# Altium schematic sheet DIOT_SMA_EXT.schdoc: DIOT_SMA16
size 594 x 420 mm; Author: A.B.; CompanyName: WUT; DrawnBy: A.B.; Organization: WUT ISE; Address1: Warsaw Univeristy of Technology; Address2: Nowowiejska 15/19; DocumentNumber: 1; SheetNumber: 1; SheetTotal: 2; EDA_Number: DIOT; Projet: KASLI 3U subsystem; ModifiedBy: -; CreateDate: XX/XX/XXXX; CheckedDate: -; DivGrp: ISE; Designer: A.B.; ModifiedDate: -; ProjectName: KASLI 3U subsystem
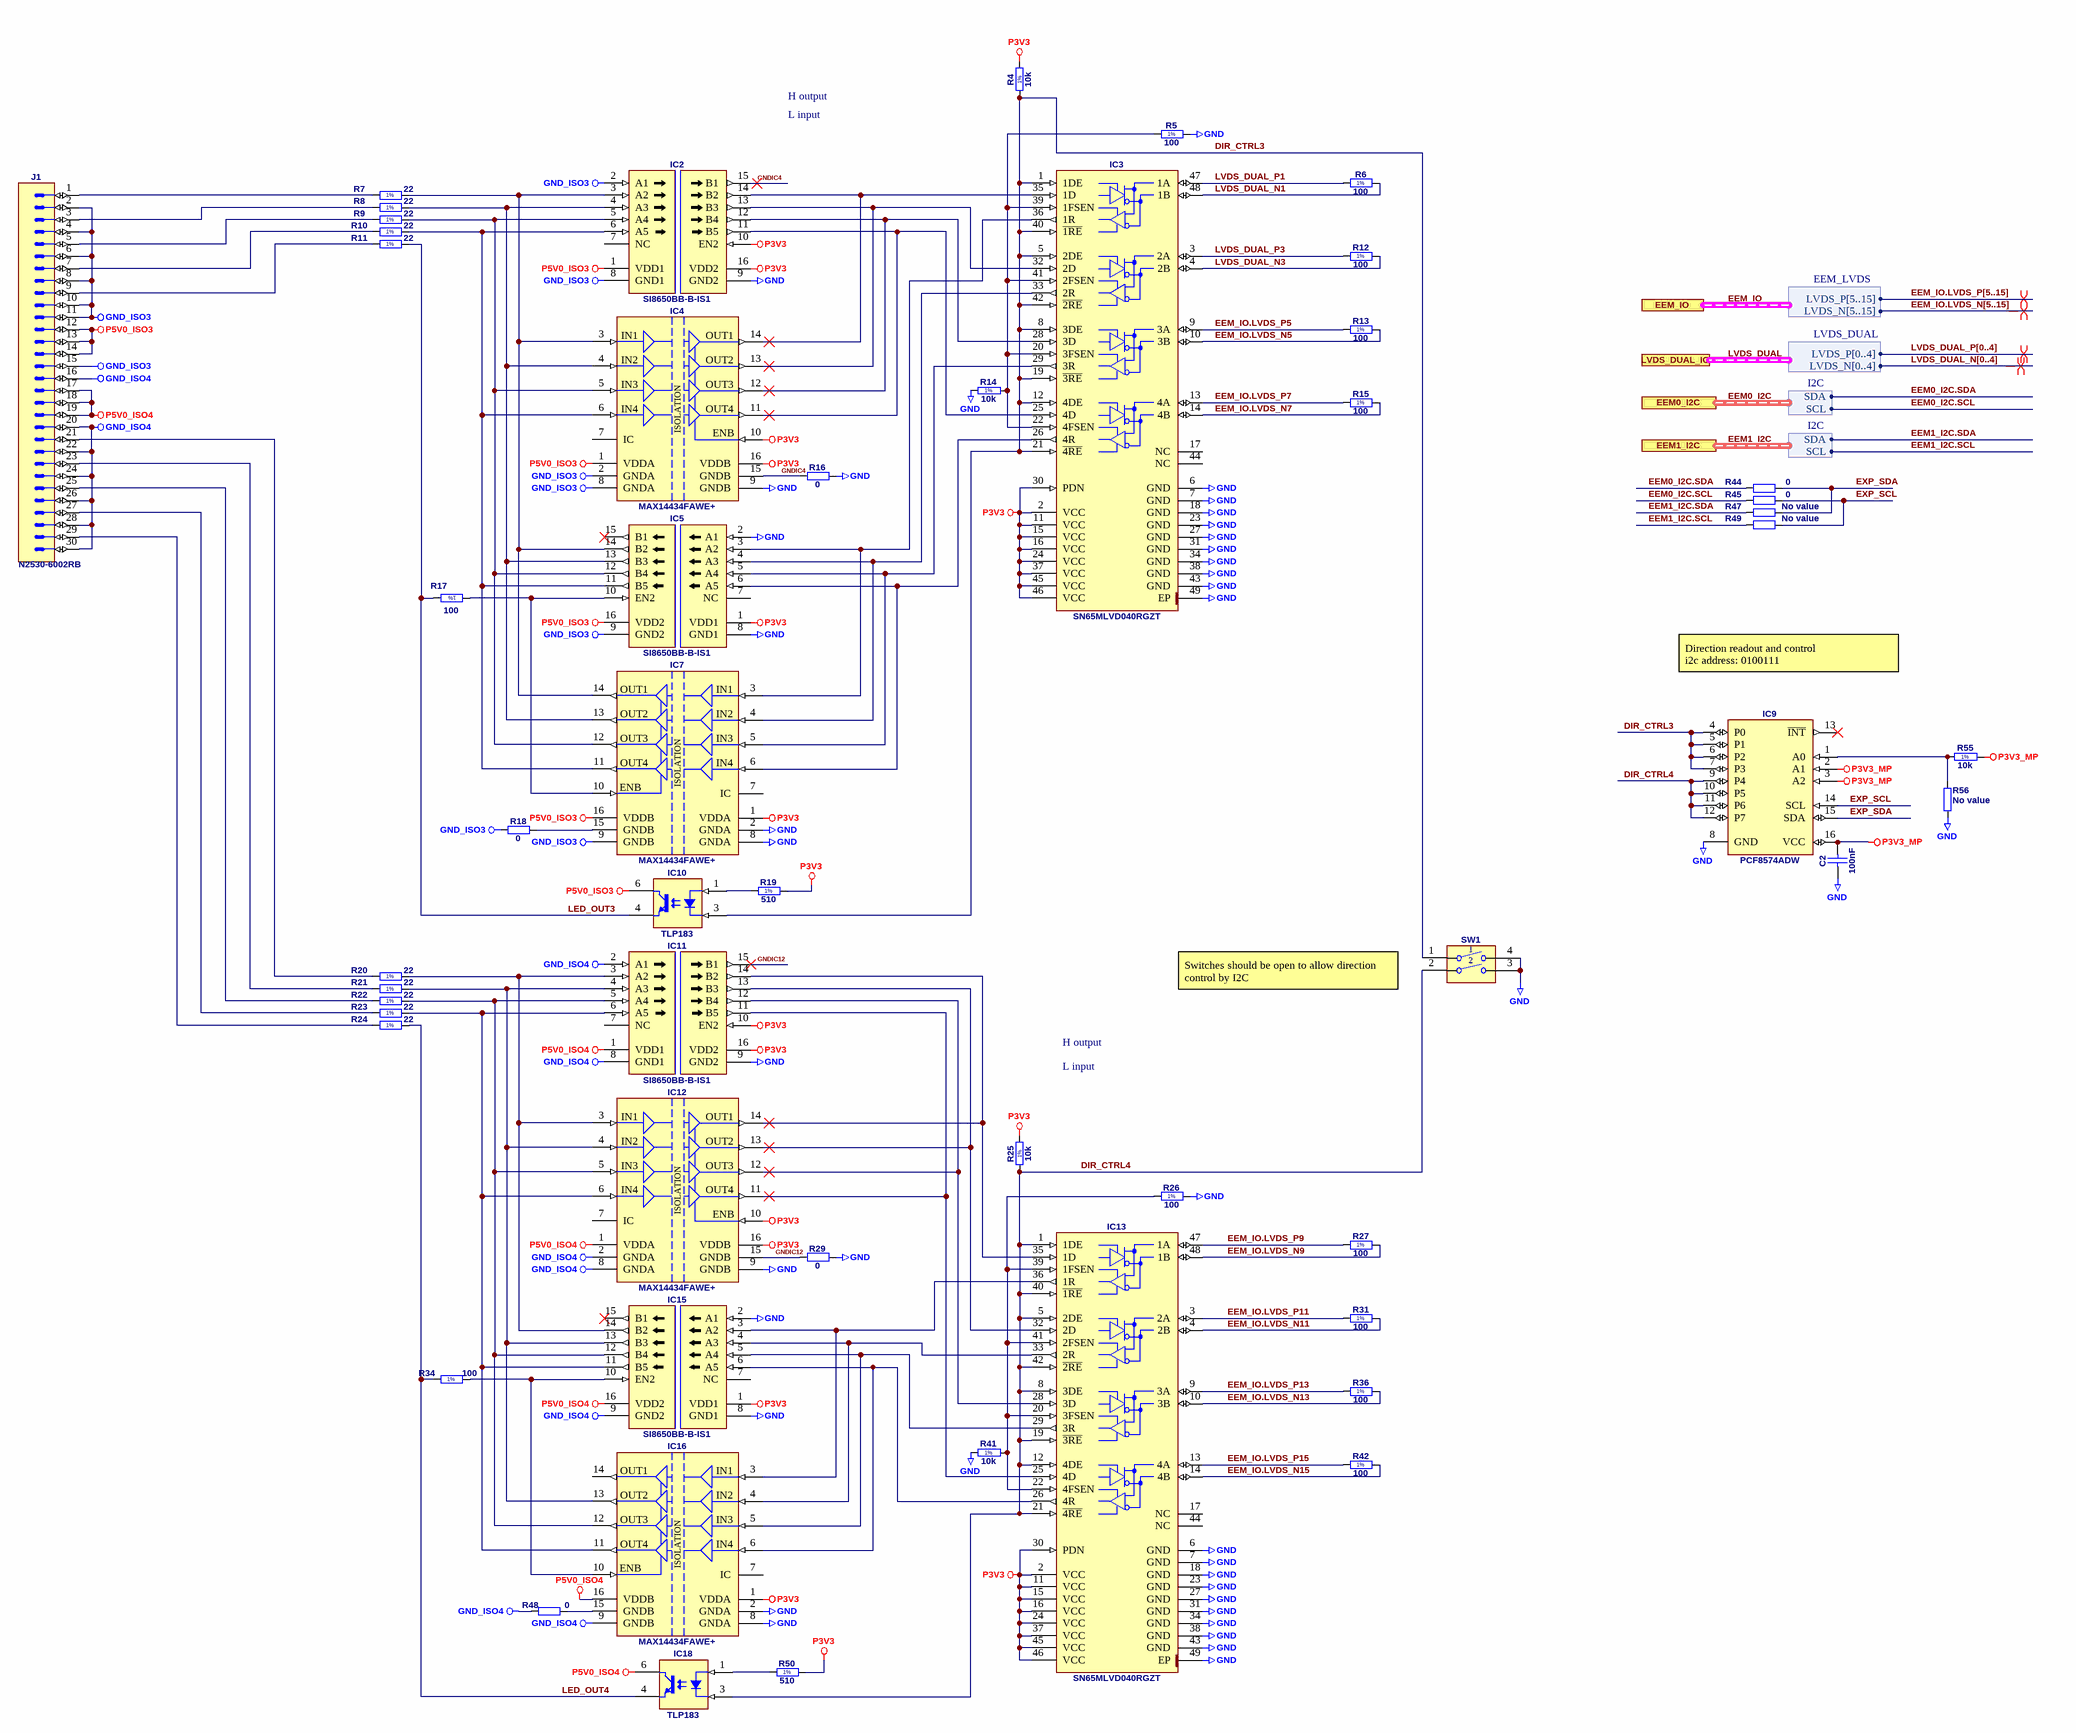
[diagram p0: DIOT_SMA_EXT.schdoc]

## Parts
C2  100nF  [CAPC1005X55N]
IC2  SI8650BB-B-IS1  [SOIC127P600X175-16N]
IC3  SN65MLVD040RGZT  [QFN50P700X700X100-49N-S420]
IC4  MAX14434FAWE+  [SOIC127P1030X265-16N]
IC5  SI8650BB-B-IS1  [SOIC127P600X175-16N]
IC7  MAX14434FAWE+  [SOIC127P1030X265-16N]
IC9  PCF8574ADW  [SOIC127P1030X265-16N]
IC10  TLP183  [TOSHIBA_11-4M1S]
IC11  SI8650BB-B-IS1  [SOIC127P600X175-16N]
IC12  MAX14434FAWE+  [SOIC127P1030X265-16N]
IC13  SN65MLVD040RGZT  [QFN50P700X700X100-49N-S420]
IC15  SI8650BB-B-IS1  [SOIC127P600X175-16N]
IC16  MAX14434FAWE+  [SOIC127P1030X265-16N]
IC18  TLP183  [TOSHIBA_11-4M1S]
J1  Manufacturer Part Number: N2530-6002RB  [3M_N2530-6002RB]
R4  10k  [RESC1005X40N]
R5  100  [RESC1005X40N]
R6  100  [RESC1005X40N]
R7  22  [RESC1005X40N]
R8  22  [RESC1005X40N]
R9  22  [RESC1005X40N]
R10  22  [RESC1005X40N]
R11  22  [RESC1005X40N]
R12  100  [RESC1005X40N]
R13  100  [RESC1005X40N]
R14  10k  [RESC1005X40N]
R15  100  [RESC1005X40N]
R16  0  [RESC1005X40N]
R17  100  [RESC1005X40N]
R18  0  [RESC1005X40N]
R19  510  [RESC1005X40N]
R20  22  [RESC1005X40N]
R21  22  [RESC1005X40N]
R22  22  [RESC1005X40N]
R23  22  [RESC1005X40N]
R24  22  [RESC1005X40N]
R25  10k  [RESC1005X40N]
R26  100  [RESC1005X40N]
R27  100  [RESC1005X40N]
R29  0  [RESC1005X40N]
R31  100  [RESC1005X40N]
R34  100  [RESC1005X40N]
R36  100  [RESC1005X40N]
R41  10k  [RESC1005X40N]
R42  100  [RESC1005X40N]
R44  0  [RESC1005X40N]
R45  0  [RESC1005X40N]
R47  No value  [RESC1005X40N]
R48  0  [RESC1005X40N]
R49  No value  [RESC1005X40N]
R50  510  [RESC1005X40N]
R55  10k  [RESC1005X40N]
R56  No value  [RESC1005X40N]
SW1  Switch  [SW_OMRON_A6S-2102-H]  (value not drawn)

## Ports
EEM0_I2C (harness I2C), EEM1_I2C (harness I2C), EEM_IO (harness EEM_LVDS), LVDS_DUAL_IO (harness LVDS_DUAL)

## Harnesses
EEM_LVDS: LVDS_P[5..15], LVDS_N[5..15]
LVDS_DUAL: LVDS_P[0..4], LVDS_N[0..4]
I2C: SDA, SCL

## Nets
GND: C2.1 IC2.9(GND2) IC3.6(GND) IC3.7(GND) IC3.18(GND) IC3.23(GND) IC3.27(GND) IC3.31(GND) IC3.34(GND) IC3.38(GND) IC3.43(GND) IC3.49(EP) IC4.9(GNDB) IC5.2(A1) IC5.8(GND1) IC7.2(GNDA) IC7.8(GNDA) IC9.8(GND) IC11.9(GND2) IC12.9(GNDB) IC13.6(GND) IC13.7(GND) IC13.18(GND) IC13.23(GND) IC13.27(GND) IC13.31(GND) IC13.34(GND) IC13.38(GND) IC13.43(GND) IC13.49(EP) IC15.2(A1) IC15.8(GND1) IC16.2(GNDA) IC16.8(GNDA) R5.2 R14.2 R16.2 R26.2 R29.2 R41.2 R56.1 SW1.3 SW1.4
GND_ISO3: IC2.2(A1) IC2.8(GND1) IC4.2(GNDA) IC4.8(GNDA) IC5.9(GND2) IC7.9(GNDB) J1.2 J1.4 J1.6 J1.8 J1.10 J1.11 J1.15 R18.1
GND_ISO4: IC11.2(A1) IC11.8(GND1) IC12.2(GNDA) IC12.8(GNDA) IC15.9(GND2) IC16.9(GNDB) J1.16 J1.20 J1.22 J1.24 J1.26 J1.28 J1.30 R48.1
P3V3: IC2.10(EN2) IC2.16(VDD2) IC3.2(VCC) IC3.11(VCC) IC3.15(VCC) IC3.16(VCC) IC3.24(VCC) IC3.30(PDN) IC3.37(VCC) IC3.45(VCC) IC3.46(VCC) IC4.10(ENB) IC4.16(VDDB) IC5.1(VDD1) IC7.1(VDDA) IC11.10(EN2) IC11.16(VDD2) IC12.10(ENB) IC12.16(VDDB) IC13.2(VCC) IC13.11(VCC) IC13.15(VCC) IC13.16(VCC) IC13.24(VCC) IC13.30(PDN) IC13.37(VCC) IC13.45(VCC) IC13.46(VCC) IC15.1(VDD1) IC16.1(VDDA) R4.2 R19.2 R25.2 R50.2
P3V3_MP: C2.2 IC9.2(A1) IC9.3(A2) IC9.16(VCC) R55.1
P5V0_ISO3: IC2.1(VDD1) IC4.1(VDDA) IC5.16(VDD2) IC7.16(VDDB) IC10.6(C) J1.12 J1.13 J1.14
P5V0_ISO4: IC11.1(VDD1) IC12.1(VDDA) IC15.16(VDD2) IC16.16(VDDB) IC18.6(C) J1.17 J1.18 J1.19
DIR_CTRL3: IC3.1(1DE) IC3.5(2DE) IC3.8(3DE) IC3.12(4DE) IC3.19(~{3RE}) IC3.21(~{4RE}) IC3.40(~{1RE}) IC3.42(~{2RE}) IC9.4(P0) IC9.5(P1) IC9.6(P2) IC9.7(P3) IC10.3(C) R4.1 SW1.1
DIR_CTRL4: IC9.9(P4) IC9.10(P5) IC9.11(P6) IC9.12(P7) IC13.1(1DE) IC13.5(2DE) IC13.8(3DE) IC13.12(4DE) IC13.19(~{3RE}) IC13.21(~{4RE}) IC13.40(~{1RE}) IC13.42(~{2RE}) IC18.3(C) R25.1 SW1.2
EEM0_I2C.SCL: R45.1 ; port EEM0_I2C.SCL
EEM0_I2C.SDA: R44.1 ; port EEM0_I2C.SDA
EEM1_I2C.SCL: R49.1 ; port EEM1_I2C.SCL
EEM1_I2C.SDA: R47.1 ; port EEM1_I2C.SDA
EEM_IO.LVDS_N5: IC3.10(3B) R13.2
EEM_IO.LVDS_N7: IC3.14(4B) R15.2
EEM_IO.LVDS_N9: IC13.48(1B) R27.2
EEM_IO.LVDS_N11: IC13.4(2B) R31.2
EEM_IO.LVDS_N13: IC13.10(3B) R36.2
EEM_IO.LVDS_N15: IC13.14(4B) R42.2
EEM_IO.LVDS_P5: IC3.9(3A) R13.1
EEM_IO.LVDS_P7: IC3.13(4A) R15.1
EEM_IO.LVDS_P9: IC13.47(1A) R27.1
EEM_IO.LVDS_P11: IC13.3(2A) R31.1
EEM_IO.LVDS_P13: IC13.9(3A) R36.1
EEM_IO.LVDS_P15: IC13.13(4A) R42.1
EXP_SCL: IC9.14(SCL) R45.2 R49.2
EXP_SDA: IC9.15(SDA) R44.2 R47.2
GNDIC4: IC2.15(B1) IC4.15(GNDB) R16.1
GNDIC12: IC11.15(B1) IC12.15(GNDB) R29.1
LED_OUT3: IC10.4(E) R11.2 R17.2
LED_OUT4: IC18.4(E) R24.2 R34.1
LVDS_DUAL_N1: IC3.48(1B) R6.2
LVDS_DUAL_N3: IC3.4(2B) R12.2
LVDS_DUAL_P1: IC3.47(1A) R6.1
LVDS_DUAL_P3: IC3.3(2A) R12.1
NetIC2_3: IC2.3(A2) IC4.3(IN1) IC5.14(B2) IC7.14(OUT1) R7.2
NetIC2_4: IC2.4(A3) IC4.4(IN2) IC5.13(B3) IC7.13(OUT2) R8.2
NetIC2_5: IC2.5(A4) IC4.5(IN3) IC5.12(B4) IC7.12(OUT3) R9.2
NetIC2_6: IC2.6(A5) IC4.6(IN4) IC5.11(B5) IC7.11(OUT4) R10.2
NetIC2_11: IC2.11(B5) IC3.25(4D) IC4.11(OUT4)
NetIC2_12: IC2.12(B4) IC3.28(3D) IC4.12(OUT3)
NetIC2_13: IC2.13(B3) IC3.32(2D) IC4.13(OUT2)
NetIC2_14: IC2.14(B2) IC3.35(1D) IC4.14(OUT1)
NetIC3_20: IC3.20(3FSEN) IC3.22(4FSEN) IC3.39(1FSEN) IC3.41(2FSEN) R5.1 R14.1
NetIC3_26: IC3.26(4R) IC5.6(A5) IC7.6(IN4)
NetIC3_29: IC3.29(3R) IC5.5(A4) IC7.5(IN3)
NetIC3_33: IC3.33(2R) IC5.4(A3) IC7.4(IN2)
NetIC3_36: IC3.36(1R) IC5.3(A2) IC7.3(IN1)
NetIC5_10: IC5.10(EN2) IC7.10(ENB) R17.1
NetIC7_15: IC7.15(GNDB) R18.2
NetIC9_1: IC9.1(A0) R55.2 R56.2
NetIC10_1: IC10.1(A) R19.1
NetIC11_3: IC11.3(A2) IC12.3(IN1) IC15.14(B2) R20.2
NetIC11_4: IC11.4(A3) IC12.4(IN2) IC15.13(B3) IC16.13(OUT2) R21.2
NetIC11_5: IC11.5(A4) IC12.5(IN3) IC15.12(B4) IC16.12(OUT3) R22.2
NetIC11_6: IC11.6(A5) IC12.6(IN4) IC15.11(B5) IC16.11(OUT4) R23.2
NetIC11_11: IC11.11(B5) IC12.11(OUT4) IC13.25(4D)
NetIC11_12: IC11.12(B4) IC12.12(OUT3) IC13.28(3D)
NetIC11_13: IC11.13(B3) IC12.13(OUT2) IC13.32(2D)
NetIC11_14: IC11.14(B2) IC12.14(OUT1) IC13.35(1D)
NetIC13_20: IC13.20(3FSEN) IC13.22(4FSEN) IC13.39(1FSEN) IC13.41(2FSEN) R26.1 R41.1
NetIC13_26: IC13.26(4R) IC15.6(A5) IC16.6(IN4)
NetIC13_29: IC13.29(3R) IC15.5(A4) IC16.5(IN3)
NetIC13_33: IC13.33(2R) IC15.4(A3) IC16.4(IN2)
NetIC13_36: IC13.36(1R) IC15.3(A2) IC16.3(IN1)
NetIC15_10: IC15.10(EN2) IC16.10(ENB) R34.2
NetIC16_15: IC16.15(GNDB) R48.2
NetIC18_1: IC18.1(A) R50.1
NetJ1_1: J1.1 R7.1
NetJ1_3: J1.3 R8.1
NetJ1_5: J1.5 R9.1
NetJ1_7: J1.7 R10.1
NetJ1_9: J1.9 R11.1
NetJ1_21: J1.21 R20.1
NetJ1_23: J1.23 R21.1
NetJ1_25: J1.25 R22.1
NetJ1_27: J1.27 R23.1
NetJ1_29: J1.29 R24.1

Not connected (* = marked no-connect by the designer): IC2 7(NC); IC3 17(NC) 44(NC); IC4 7(IC); IC5 7(NC) 15(B1)*; IC7 7(IC); IC9 13(~{INT})*; IC11 7(NC); IC12 7(IC); IC13 17(NC) 44(NC); IC15 7(NC) 15(B1)*; IC16 7(IC) 14(OUT1)

## Buses and harness runs
bus EEM_IO.LVDS_N[5..15]
bus EEM_IO.LVDS_P[5..15]
bus LVDS_DUAL_N[0..4]
bus LVDS_DUAL_P[0..4]
harness EEM0_I2C = port EEM0_I2C
harness EEM1_I2C = port EEM1_I2C
harness EEM_IO = port EEM_IO
harness LVDS_DUAL = port LVDS_DUAL_IO

## Layout directives
differential pair; differential pair class Diff_100Ohm: (no net found under the mark)

## Notes on the sheet
- H output
- L input
- Direction readout and control
  i2c address: 0100111
- Switches should be open to allow direction control by I2C
- Project/Equipment
- Document
- File
- Designer
- Drawn by
- Check.by
- Last Mod.
- Copyright WUT ISE 2020.
  This documentation describes Open Hardware and is licensed under the CERN OHL v.1.2. You may redistribute and modify this documentation under the terms of the CERN OHL v.1.2. (http://ohwr.org/CERNOHL). This documentation is distributed WITHOUT ANY EXPRESS OR IMPLIED WARRANTY, INCLUDING OF MERCHANTABILITY, SATISFACTORY QUALITY AND FITNESS FOR A PARTICULAR PURPOSE. Please see the CERN OHL v.1.2 for applicable conditions.
- Contact
- Print Date
- Sheet
- Size
- A2
- of
- Rev
- (in symbol MAX14434FAWE+) ISOLATION
- (in symbol R0402_10K_1%_0.0625W_100PPM) 1%
- (in symbol R0402_22R_1%_0.0625W_100PPM) 1%
- (in symbol R0402_100R_1%_0.1W_100PPM) 1%
- (in symbol R0402_510R_1%_0.0625W_100PPM) 1%

## Library data of the parts
C2 = CC0402_100NF_16V_10%_X5R: Non-polarised capacitor; Part Description: SMD Multilayer Chip Ceramic Capacitor; Manufacturer: GENERIC; Manufacturer1 Part Number: GRM155R61C104KA88D; Voltage: 16V; TC: X5R; Tolerance: ±10%; Part Number: CC0402_100NF_16V_10%_X5R; Component Kind: Standard; Component Type: Standard; Pin Count: 2; Value: 100nF; Status: None; Manufacturer Part Number: CC0402_100NF_16V_10%_X5R; Case: 0402; Mounted: Yes; Socket: No; SMD: Yes; Sense: No; Manufacturer1 Example: MURATA; Manufacturer1 ComponentHeight: 0.55mm; HelpURL: \\cern.ch\dfs\Applications\Altium\Datasheets\CC0402_X5R_MURATA_GRM.pdf; Author: CERN DEM JLC; CreateDate: 10.12.2013; LatestRevisionDate: 10.12.2013
IC2 IC5 IC11 IC15 = SI8650BB-B-IS1: Low Power Five-Channel Digital Isolator; Part Description: 2.5kV 150Mbps Low Power Five-Channel Digital Isolator; Manufacturer: SKYWORKS; Manufacturer Part Number: SI8651BB-B-IS1; PressFit: No; Bonding: No; Part Number: SI8650BB-B-IS1; Component Kind: Standard; Component Type: Standard; Device: SI8650BB-B-IS1; PackageDescription: SOIC 16, Pitch 1.27mm - Body 4x10mm, IPC Medium Density; Pin Count: 16; Case: SOIC16; Mounted: Yes; Socket: No; SMD: Yes; Sense: No; ComponentHeight: 1.75mm; Author: CERN DEM HF; HelpURL: \\cern.ch\dfs\Applications\Altium\Datasheets\SI8650BB-B-IS1.pdf; CreateDate: 14.10.2021; LatestRevisionDate: 14.10.2021
IC3 IC13 = SN65MLVD040RGZT: 4-Channel Half-Duplex M-LVDS Line Transceiver; Manufacturer: TEXAS INSTRUMENTS; PressFit: No; Bonding: No; Part Number: SN65MLVD040RGZT; Component Kind: Standard; Component Type: Standard; Device: SN65MLVD040RGZT; PackageDescription: QFN, 0.50mm Pitch, Square; 48 Pin, 7.00mm L X 7.00mm W X 1mm H body (W/Thermal Tab 4.2mm X 4.2mm), IPC Medium Density; Part Description: 4-Channel Half-Duplex M-LVDS Line Transceiver; Manufacturer Part Number: SN65MLVD040RGZT; Pin Count: 49; Case: QFN48; Mounted: Yes; Socket: No; SMD: Yes; Sense: No; ComponentHeight: 1mm; Author: CERN DEM JLC; HelpURL: \\cern.ch\dfs\Applications\Altium\Datasheets\SN65MLVD040RGZT.pdf; CreateDate: 17.03.2011; LatestRevisionDate: 17.03.2011
IC4 IC7 IC12 IC16 = MAX14434FAWE+: Four-Channel, Fast, Low-Power, 5kVRMS Digital Isolators; Part Description: Four-Channel, Fast, Low-Power, 5kVRMS Digital Isolators, Data Rate 200 Mbps, Default Output Low; Manufacturer: MAXIM; PressFit: No; Bonding: No; Part Number: MAX14434FAWE+; Component Kind: Standard; Component Type: Standard; Device: MAX14434FAWE+; PackageDescription: SOIC, 1.27mm Pitch; 16 Pin, 7.50mm W X 10.3mm L X 2.65mm H body, IPC Medium Density; Manufacturer Part Number: MAX14434FAWE+; Pin Count: 16; Case: SOIC16W; Mounted: Yes; Socket: No; SMD: Yes; Sense: No; ComponentHeight: 2.65mm; Author: CERN DEM HF; HelpURL: \\cern.ch\dfs\Applications\Altium\Datasheets\MAX14434.pdf; CreateDate: 29.11.2021; LatestRevisionDate: 29.11.2021
IC9 = PCF8574ADW: Remote 8-bit I/O Expander For I2C Bus; Manufacturer: TEXAS INSTRUMENTS; PressFit: No; Bonding: No; Part Number: PCF8574ADW; Component Kind: Standard; Component Type: Standard; Device: PCF8574ADW; PackageDescription: SOIC 16, Pitch 1.27mm - Body 7.5x10.3mm, IPC Medium Density; Part Description: Remote 8-bit I/O Expander For I2C Bus; Manufacturer Part Number: PCF8574ADW; Pin Count: 16; Case: SOIC16W; Mounted: Yes; Socket: No; SMD: Yes; Sense: No; ComponentHeight: 2.65mm; Author: CERN DEM JLC; HelpURL: \\cern.ch\dfs\Applications\Altium\Datasheets\PCF8574ADW.pdf; CreateDate: 01.11.2012; LatestRevisionDate: 01.11.2012
IC10 IC18 = TLP183: Single Optocoupler; Part Description: Photocoupler InGaAs Infrared LED & Photo-Transistor; Manufacturer: TOSHIBA; PressFit: No; Bonding: No; Part Number: TLP183; Component Kind: Standard; Component Type: Standard; Device: TLP183; PackageDescription: SOIC, 1.27mm Pitch; 4 Pin, TOSHIBA Case (5mm Creepage); Manufacturer Part Number: TLP183; Pin Count: 4; Case: SOIC4; Mounted: Yes; Socket: No; SMD: Yes; Sense: No; ComponentHeight: 2.3mm; HelpURL: \\cern.ch\dfs\Applications\Altium\Datasheets\TLP183.pdf; Author: CERN DEM JMW; CreateDate: 05.10.2015; LatestRevisionDate: 04.09.2017
J1 = 3M_N2530-6002RB: Connector 30 Male; Part Description: 30 Contacts - Straight .100'' x .100'' Low Profile Four-Wall Header, 2500 Series; Manufacturer: 3M; PressFit: No; Part Number: 3M_N2530-6002RB; Component Kind: Standard; Component Type: Standard; Pin Count: 30; Family: Header 30; Mounted: Yes; Socket: No; SMD: No; Sense: No; Status: None; ComponentHeight: 10.03mm; HelpURL: \\cern.ch\dfs\Applications\Altium\Datasheets\3M_N2530-6002RB.pdf; Author: CERN DEM JLC; CreateDate: 11.02.2009; LatestRevisionDate: 11.08.2009
R4 R14 R25 R41 R55 = R0402_10K_1%_0.0625W_100PPM: Resistor - 1%; Part Description: General Purpose Thick Film Chip Resistor; Manufacturer: GENERIC; Manufacturer1 Part Number: 232270671003L; TC: ±100ppm/°C; Part Number: R0402_10K_1%_0.0625W_100PPM; Component Kind: Standard; Component Type: Standard; Pin Count: 2; Value: 10k; Status: Not recommended; Power: 0.0625W; Tolerance: ±1%; Manufacturer Part Number: R0402_10K_1%_0.0625W_100PPM; Case: 0402; Mounted: Yes; Sense: No; Socket: No; SMD: Yes; Manufacturer1 Example: YAGEO PHYCOMP; Manufacturer1 ComponentHeight: 0.4mm; HelpURL: \\cern.ch\dfs\Applications\Altium\Datasheets\R0402_Phycomp_RC0402.pdf; Author: CERN DEM JLC; CreateDate: 03.12.2007; LatestRevisionDate: 17.10.2012
R5 R6 R12 R13 R15 R17 R26 R27 R31 R34 R36 R42 = R0402_100R_1%_0.1W_100PPM: Resistor - 1%; Part Description: General Purpose Thick Film Chip Resistor; Manufacturer: GENERIC; Manufacturer Part Number: R0402_100R_1%_0.1W_100PPM_50V; Manufacturer1 Part Number: ERJ2RKF1000X; Power: 0.1W; TC: ±100ppm/°C; Voltage: 50V; Part Number: R0402_100R_1%_0.1W_100PPM; Component Kind: Standard; Component Type: Standard; Pin Count: 2; Value: 100; Status: Not recommended; Tolerance: ±1%; Case: 0402; Mounted: Yes; Sense: No; Socket: No; SMD: Yes; Manufacturer1 Example: PANASONIC; Manufacturer1 ComponentHeight: 0.4mm; HelpURL: \\cern.ch\dfs\Applications\Altium\Datasheets\R0402_PANASONIC_ERJ2RK.pdf; Author: CERN DEM JLC; CreateDate: 12.12.2013; LatestRevisionDate: 03.03.2015
R7-R11 R20-R24 = R0402_22R_1%_0.0625W_100PPM: Resistor - 1%; Part Description: General Purpose Thick Film Chip Resistor; Manufacturer: GENERIC; Manufacturer1 Part Number: 232270672209L; TC: ±100ppm/°C; PressFit: No; Part Number: R0402_22R_1%_0.0625W_100PPM; Component Kind: Standard; Component Type: Standard; Pin Count: 2; Value: 22; Status: Not Recommended; Power: 0.0625W; Tolerance: ±1%; Manufacturer Part Number: R0402_22R_1%_0.0625W_100PPM; Case: 0402; Mounted: Yes; Sense: No; Socket: No; SMD: Yes; Manufacturer1 Example: YAGEO PHYCOMP; Manufacturer1 ComponentHeight: 0.4mm; HelpURL: \\cern.ch\dfs\Applications\Altium\Datasheets\R0402_Phycomp_RC0402.pdf; Author: CERN DEM JLC; CreateDate: 03.12.2007; LatestRevisionDate: 17.10.2012
R16 R18 R29 R44 R45 R47-R49 R56 = R0402_0R_JUMPER: Resistor; Part Description: 1A (0.05R Max DC Resistance) Zero Ohm Jumper; Manufacturer: GENERIC; Manufacturer1 Part Number: 232270591001L; PressFit: No; Part Number: R0402_0R_JUMPER; Component Kind: Standard; Component Type: Standard; Pin Count: 2; Status: Not Recommended; Manufacturer Part Number: R0402_0R_JUMPER; Case: 0402; Mounted: Yes; Sense: No; Socket: No; SMD: Yes; Manufacturer1 Example: YAGEO PHYCOMP; Manufacturer1 ComponentHeight: 0.4mm; HelpURL: \\cern.ch\dfs\Applications\Altium\Datasheets\R0402_Phycomp_RC0402.pdf; Author: CERN DEM JLC; CreateDate: 03.12.2007; LatestRevisionDate: 17.10.2012
  R16 R18 R29 R44 R45 R48: Value: 0
  R47 R49 R56: Value: No value
R19 R50 = R0402_510R_1%_0.0625W_100PPM: Resistor - 1%; Part Description: General Purpose Thick Film Chip Resistor; Manufacturer: GENERIC; Manufacturer1 Part Number: 232270675101L; TC: ±100ppm/°C; Part Number: R0402_510R_1%_0.0625W_100PPM; Component Kind: Standard; Component Type: Standard; Pin Count: 2; Value: 510; Status: Not recommended; Power: 0.0625W; Tolerance: ±1%; Manufacturer Part Number: R0402_510R_1%_0.0625W_100PPM; Case: 0402; Mounted: Yes; Sense: No; Socket: No; SMD: Yes; Manufacturer1 Example: YAGEO PHYCOMP; Manufacturer1 ComponentHeight: 0.4mm; HelpURL: \\cern.ch\dfs\Applications\Altium\Datasheets\R0402_Phycomp_RC0402.pdf; Author: CERN DEM JLC; CreateDate: 03.12.2007; LatestRevisionDate: 17.10.2012
SW1 = SW_OMRON_A6S-2102-H: 2 Ways SPST DIP Switch; Part Description: 2 Ways SPST DIP Switch, White Flat Actuator with Seal Tape, Contact Rating 25mA 24VDC; Manufacturer: OMRON; PressFit: No; Part Number: SW_OMRON_A6S-2102-H; Component Kind: Standard; Component Type: Standard; Pin Count: 4; PackageDescription: Pitch 2.54mm, Body 6.2x6.4mm, 2 Ways SPST Surface-Mounting DIP Switch, OMRON A6S-H; Family: Switch; Mounted: Yes; Socket: No; SMD: Yes; Sense: No; Status: None; Manufacturer Part Number: A6S-2102-H; ComponentHeight: 3.8mm; HelpURL: \\cern.ch\dfs\Applications\Altium\Datasheets\SW_OMRON_A6S-2102-H.pdf; Author: CERN DEM JMW; CreateDate: 25.09.2008; LatestRevisionDate: 25.09.2008